# EAGLE design untitled (EAGLE 9.6.2)
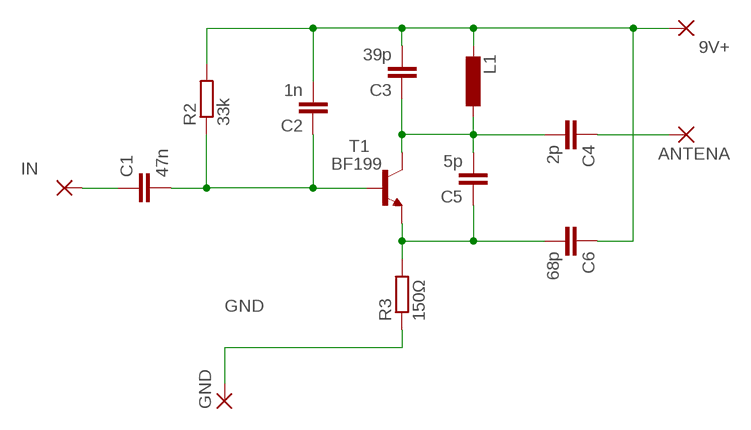
[diagram p0: schematic, sheet 1]

## Parts
9V+  3,81/1,4  [3,81/1,4]
ANTENA  3,81/1,4  [3,81/1,4]
C1  47n  C-EU025-025X050  [C025-025X050]
C2  1n  C-EU025-025X050  [C025-025X050]
C3  39p  C-EU025-025X050  [C025-025X050]
C4  2p  C-EU025-025X050  [C025-025X050]
C5  5p  C-EU025-025X050  [C025-025X050]
C6  68p  C-EU025-025X050  [C025-025X050]
GND  3,81/1,4  [3,81/1,4]
IN  3,81/1,4  [3,81/1,4]
L1  L-EU0207/7  [0207/7]
R2  33k  R-EU_0207/10  [0207/10]
R3  150Ω  R-EU_0207/10  [0207/10]
T1  BF199  [TO92]

## Nets
GND: GND.1(P) R3.1
N$1: C1.1 IN.1(P)
N$3: C1.2 C2.1 R2.1 T1.1(B)
N$5: C5.1 C6.2 R3.2 T1.2(E)
N$6: C3.1 C4.2 C5.2 L1.1 T1.3(C)
N$7: 9V+.1(P) C2.2 C3.2 C6.1 L1.2 R2.2
N$8: ANTENA.1(P) C4.1

## Library data of the parts
9V+ ANTENA GND IN = wirepad:3,81/1,4: THROUGH-HOLE PAD
C1-C6 = rcl:C-EU: CAPACITOR, European symbol; SPICEPREFIX: C
L1 = rcl:L-EU: INDUCTOR, European symbol; SPICEPREFIX: L
R2 R3 = rcl:R-EU_: RESISTOR, European symbol; SPICEPREFIX: R
T1 = transistor-npn:BF199*: NPN Transistor

## Board
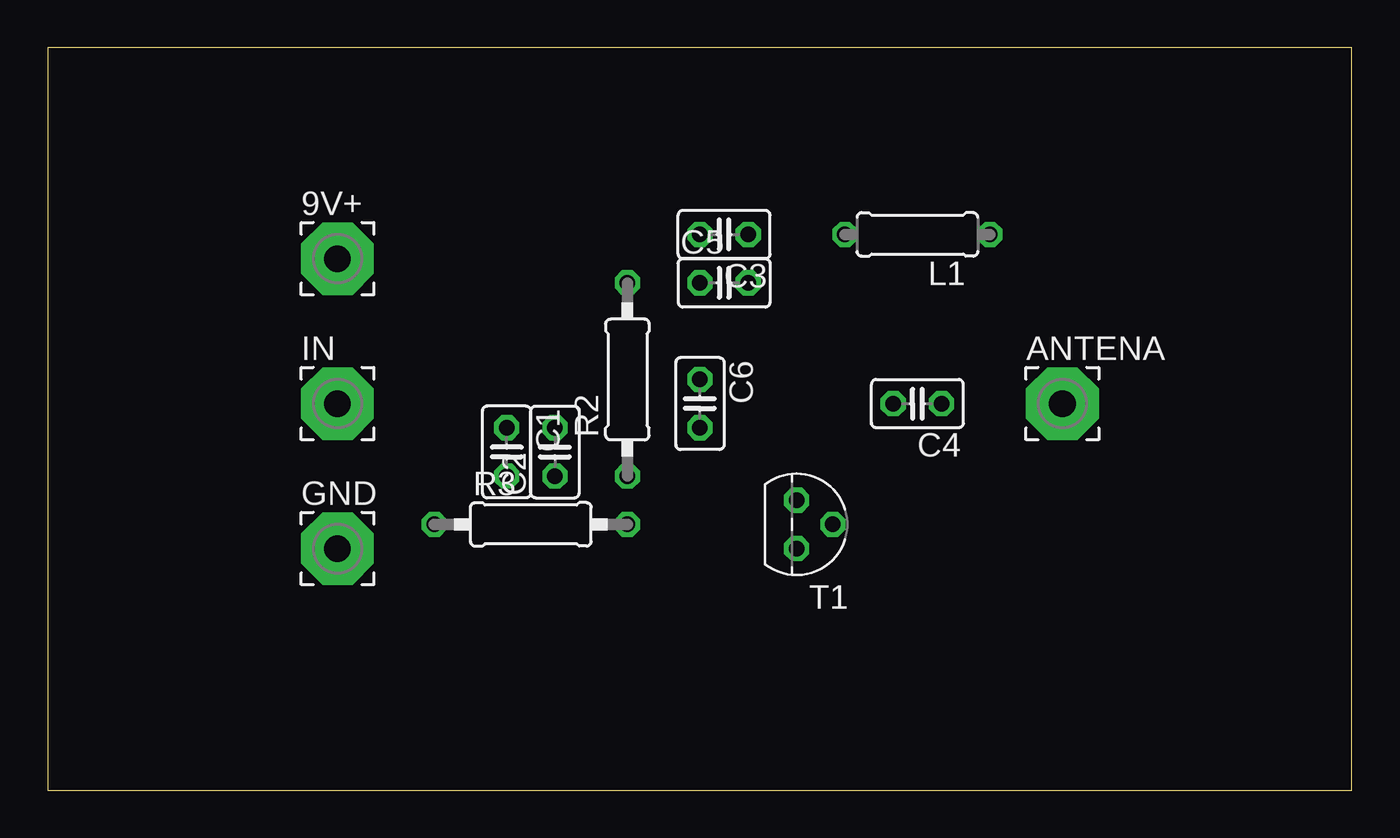
[diagram p1: board, top side]
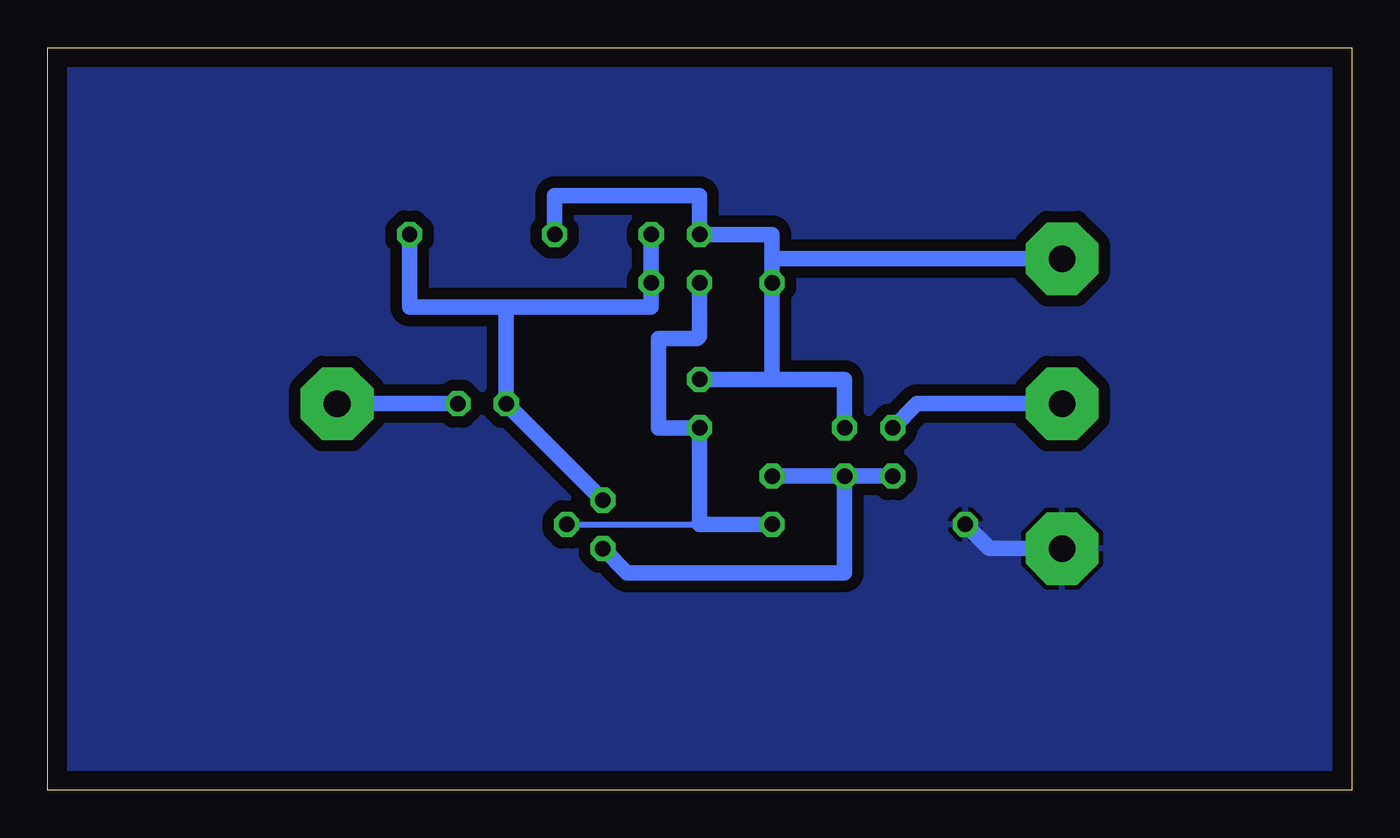
[diagram p2: board, bottom side, seen from below]

Size 68.56 x 39.04 mm. Coordinates in mm from the lower left corner, seen from the top.
Outline: 0,0 68.56,0 68.56,39.04 0,39.04 0,0
Copper layers (1*16): Top 0.035mm / dielectric 1.5mm / Bottom 0.035mm
Design rules "default *": minimum track width 6mil, minimum drill 0.35mm, track to track 6mil, track to pad 6mil, pad to pad 6mil, via to via 6mil, smd to smd 6mil, copper to edge 40mil, drill to drill 6mil, minimum pad ring 10mil, minimum via ring 8mil, stop-mask expansion 4mil, vias tented up to drill 0mil, thermal gap 10mil

### Footprints (pad centres in the part's own frame; a part is rotated, then mirrored left to right if it is on the bottom)
3,81/1,4 = drill 1.397 pad 3.81 octagon: 1 0,0
C025-025X050 = drill 0.813 octagon: 1 -1.27,0; 2 1.27,0
0207/7 = drill 0.813 octagon: 1 -3.81,0; 2 3.81,0
0207/10 = drill 0.813 octagon: 1 -5.08,0; 2 5.08,0
TO92 = drill 0.813 octagon: 1 1.27,0; 2 0,1.905; 3 -1.27,0

### Placement (x,y rotation side)
9V+  15.24,27.94 0 top
ANTENA  53.34,20.32 0 top
C1  24.13,17.78 270 top
C2  26.67,17.78 90 top
C3  35.56,29.21 180 top
C4  45.72,20.32 180 top
C5  35.56,26.67 0 top
C6  34.29,20.32 270 top
GND  15.24,12.7 0 top
IN  15.24,20.32 0 top
L1  45.72,29.21 180 top
R2  30.48,21.59 90 top
R3  25.4,13.97 0 top
T1  39.37,13.97 270 top

### Tracks (layer width: path | path; a pad name or v marks a point on that pad's centre or on a via)
GND
  Bottom 0.813: GND.1 19.05,12.7 R3.1
  pour Bottom (isolate 0.61): 0,39.37 68.58,39.37 68.58,0 0,0
N$1
  Bottom 0.813: IN.1 22.86,20.32 C1.1
N$3
  Bottom 0.813: R2.1 C2.1 | C2.1 C1.2 | T1.1 38.1,11.43 26.67,11.43 C2.1
N$5
  Bottom 0.305: T1.2 34.29,13.97
  Bottom 0.813: R3.2 34.29,13.97 C6.2 36.45,19.05 36.45,23.75 34.42,23.75 34.29,23.88 C5.1
N$6
  Bottom 0.813: 44.45,25.4 C4.2 T1.3 | 44.45,25.4 49.53,25.4 L1.1 | 44.45,25.4 36.83,25.4 C5.2 C3.1
N$7
  Bottom 0.813: 9V+.1 30.48,27.94 | 30.48,27.94 R2.2 30.48,21.59 | 30.48,27.94 30.48,29.21 C3.2 34.29,31.27 41.91,31.27 L1.2 | 30.48,21.59 C6.1 | C2.2 26.67,21.59 30.48,21.59
N$8
  Bottom 0.813: C4.1 ANTENA.1